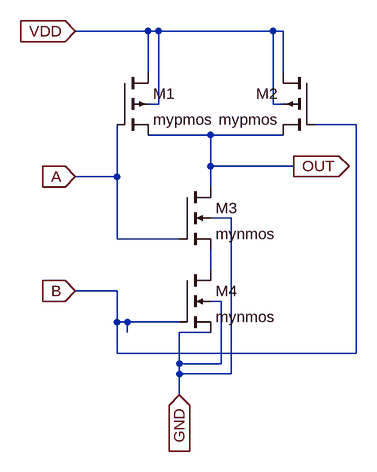
[diagram p0: schematic NAND_CORE.asc]
NAND_CORE.asc, the LTspice schematic file:
Version 4.1
SHEET 1 880 680
WIRE 256 0 144 0
WIRE 272 0 256 0
WIRE 448 0 272 0
WIRE 464 0 448 0
WIRE 256 64 256 0
WIRE 464 64 464 0
WIRE 272 112 272 0
WIRE 272 112 256 112
WIRE 448 112 448 0
WIRE 464 112 448 112
WIRE 576 144 512 144
WIRE 352 160 256 160
WIRE 464 160 352 160
WIRE 352 208 352 160
WIRE 480 208 352 208
WIRE 208 224 208 144
WIRE 208 224 144 224
WIRE 352 240 352 208
WIRE 384 288 352 288
WIRE 208 320 208 224
WIRE 304 320 208 320
WIRE 352 368 352 336
WIRE 208 400 144 400
WIRE 368 416 352 416
WIRE 208 448 208 400
WIRE 224 448 208 448
WIRE 304 448 224 448
WIRE 224 464 224 448
WIRE 352 464 304 464
WIRE 208 496 208 448
WIRE 576 496 576 144
WIRE 576 496 208 496
WIRE 304 512 304 464
WIRE 368 512 368 416
WIRE 368 512 304 512
WIRE 304 528 304 512
WIRE 384 528 384 288
WIRE 384 528 304 528
WIRE 304 560 304 528
FLAG 480 208 OUT
IOPIN 480 208 Out
FLAG 144 224 A
IOPIN 144 224 In
FLAG 144 400 B
IOPIN 144 400 In
FLAG 144 0 VDD
IOPIN 144 0 In
FLAG 304 560 GND
IOPIN 304 560 In
SYMBOL pmos4 208 64 R0
SYMATTR InstName M1
SYMATTR Value mypmos
SYMBOL pmos4 512 64 M0
SYMATTR InstName M2
SYMATTR Value mypmos
SYMBOL nmos4 304 240 R0
SYMATTR InstName M3
SYMATTR Value mynmos
SYMBOL nmos4 304 368 R0
SYMATTR InstName M4
SYMATTR Value mynmos

The netlist it stands for:
* NAND_CORE.asc
M1 VDD A OUT VDD mypmos
M2 VDD B OUT VDD mypmos
M3 OUT A N001 GND mynmos
M4 N001 B GND GND mynmos
.model NMOS NMOS
.model PMOS PMOS
.lib standard.mos
.backanno
.end